# Altium project dish_controller.PrjPCB
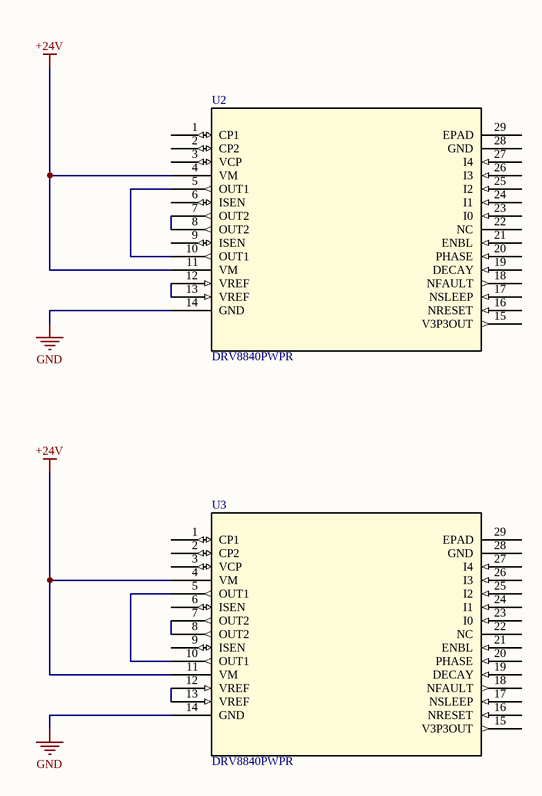
[diagram p0: h_bridge.SchDoc]
4 sheets, 4 parts. Net scope: global (net labels, ports and power ports of the same name join across sheets).
Sheets:
  h_bridge.SchDoc
  comms.SchDoc
  power.SchDoc
  micro.SchDoc

## Sheet h_bridge.SchDoc
size A4; Organization: Altium Limited; Address1: L3, 12a Rodborough Rd; Address2: Frenchs Forest; Address3: NSW; Address4: Australia 2086

### Parts
U2  DRV8840PWPR  [PWP28_5P18X3P1]
U3  DRV8840PWPR  [PWP28_5P18X3P1]

### Nets
+24V: U2.4(VM) U2.11(VM) U3.4(VM) U3.11(VM)
GND: U2.14(GND) U3.14(GND)
NetU2_5: U2.5(OUT1) U2.10(OUT1)
NetU2_7: U2.7(OUT2) U2.8(OUT2)
NetU2_12: U2.12(VREF) U2.13(VREF)
NetU3_5: U3.5(OUT1) U3.10(OUT1)
NetU3_7: U3.7(OUT2) U3.8(OUT2)
NetU3_12: U3.12(VREF) U3.13(VREF)

Not connected (* = marked no-connect by the designer): U2 1(CP1) 2(CP2) 3(VCP) 6(ISEN) 9(ISEN) 15(V3P3OUT) 16(NRESET) 17(NSLEEP) 18(NFAULT) 19(DECAY) 20(PHASE) 21(ENBL) 22(NC) 23(I0) 24(I1) 25(I2) 26(I3) 27(I4) 28(GND) 29(EPAD); U3 1(CP1) 2(CP2) 3(VCP) 6(ISEN) 9(ISEN) 15(V3P3OUT) 16(NRESET) 17(NSLEEP) 18(NFAULT) 19(DECAY) 20(PHASE) 21(ENBL) 22(NC) 23(I0) 24(I1) 25(I2) 26(I3) 27(I4) 28(GND) 29(EPAD)

### Notes on the sheet
- Title
- Size:
- Date:
- A4
- Number:
- Time:
- Revision:
- Sheet
- of
- File:

### Library data of the parts
U2 U3 = DRV8840PWPR: Imported; Manufacturer: Texas Instruments; Built_By: EMA_UL_Team; C: Copyright (C) 2015 Accelerated Designs. All rights reserved; Vendor: Texas Instruments; Manufacturer_Part_Number: DRV8840PWPR; RefDes: RefDes; Type: DEV; Value: Value

## Sheet comms.SchDoc
size A4; Organization: Altium Limited; Address1: L3, 12a Rodborough Rd; Address2: Frenchs Forest; Address3: NSW; Address4: Australia 2086
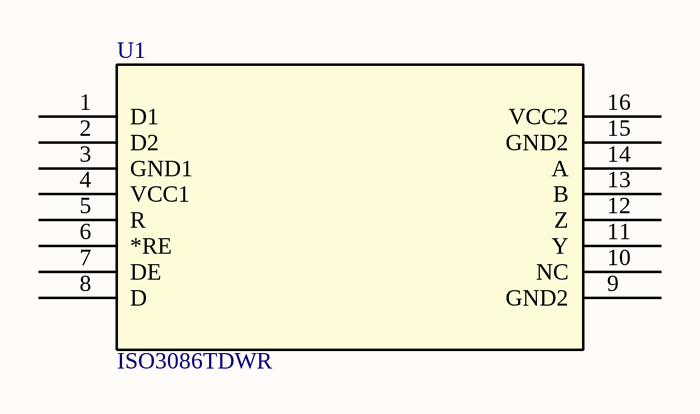
[diagram p1: comms.SchDoc]

### Parts
U1  ISO3086TDWR  [DW16]

### Nets

Not connected (* = marked no-connect by the designer): U1 1(D1) 2(D2) 3(GND1) 4(VCC1) 5(R) 6(*RE) 7(DE) 8(D) 9(GND2) 10(NC) 11(Y) 12(Z) 13(B) 14(A) 15(GND2) 16(VCC2)

### Notes on the sheet
- Title
- Size:
- Date:
- A4
- Number:
- Time:
- Revision:
- Sheet
- of
- File:

### Library data of the parts
U1 = ISO3086TDWR: Imported; Manufacturer: Texas Instruments; Built_By: EMA_UL_Team; C: Copyright (C) 2015 Accelerated Designs. All rights reserved; Vendor: Texas Instruments; Manufacturer_Part_Number: ISO3086TDWR; RefDes: RefDes; Type: DEV; Value: Value

## Sheet power.SchDoc
size A4; Organization: Altium Limited; Address1: L3, 12a Rodborough Rd; Address2: Frenchs Forest; Address3: NSW; Address4: Australia 2086

### Notes on the sheet
- Title
- Size:
- Date:
- A4
- Number:
- Time:
- Revision:
- Sheet
- of
- File:

## Sheet micro.SchDoc
size A4; Organization: Altium Limited; Address1: L3, 12a Rodborough Rd; Address2: Frenchs Forest; Address3: NSW; Address4: Australia 2086
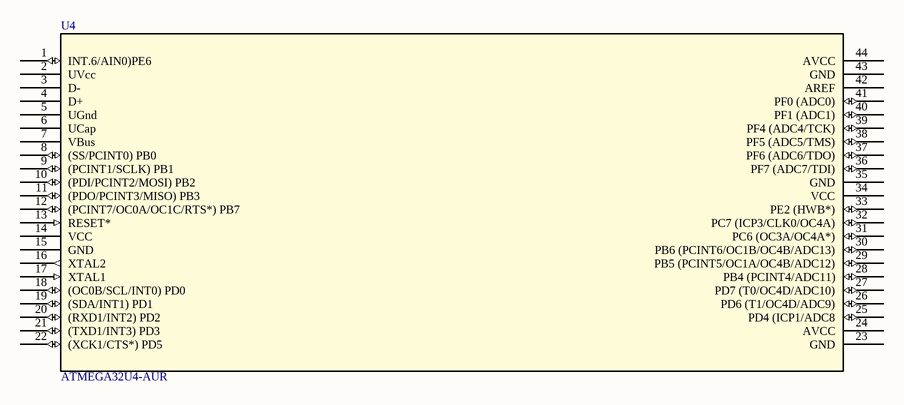
[diagram p2: micro.SchDoc]

### Parts
U4  ATMEGA32U4-AUR  [44ML]

### Nets

Not connected (* = marked no-connect by the designer): U4 1(INT.6/AIN0)PE6) 2(UVcc) 3(D-) 4(D+) 5(UGnd) 6(UCap) 7(VBus) 8((SS/PCINT0)_PB0) 9((PCINT1/SCLK)_PB1) 10((PDI/PCINT2/MOSI)_PB2) 11((PDO/PCINT3/MISO)_PB3) 12((PCINT7/OC0A/OC1C/RTS*)_PB7) 13(RESET*) 14(VCC) 15(GND) 16(XTAL2) 17(XTAL1) 18((OC0B/SCL/INT0)_PD0) 19((SDA/INT1)_PD1) 20((RXD1/INT2)_PD2) 21((TXD1/INT3)_PD3) 22((XCK1/CTS*)_PD5) 23(GND) 24(AVCC) 25(PD4_(ICP1/ADC8) 26(PD6_(T1/OC4D/ADC9)) 27(PD7_(T0/OC4D/ADC10)) 28(PB4_(PCINT4/ADC11)) 29(PB5_(PCINT5/OC1A/OC4B/ADC12)) 30(PB6_(PCINT6/OC1B/OC4B/ADC13)) 31(PC6_(OC3A/OC4A*)) 32(PC7_(ICP3/CLK0/OC4A)) 33(PE2_(HWB*)) 34(VCC) 35(GND) 36(PF7_(ADC7/TDI)) 37(PF6_(ADC6/TDO)) 38(PF5_(ADC5/TMS)) 39(PF4_(ADC4/TCK)) 40(PF1_(ADC1)) 41(PF0_(ADC0)) 42(AREF) 43(GND) 44(AVCC)

### Notes on the sheet
- Title
- Size:
- Date:
- A4
- Number:
- Time:
- Revision:
- Sheet
- of
- File:

### Library data of the parts
U4 = ATMEGA32U4-AUR: Imported; Vendor: Atmel; Built_By: EMA_UL_Team; C: Copyright (C) 2015 Accelerated Designs. All rights reserved; Manufacturer_Part_Number: ATMEGA32U4-AUR; RefDes: RefDes; Type: DEV; Value: Value